# Altium project Dual_tone_generator.PrjPcb
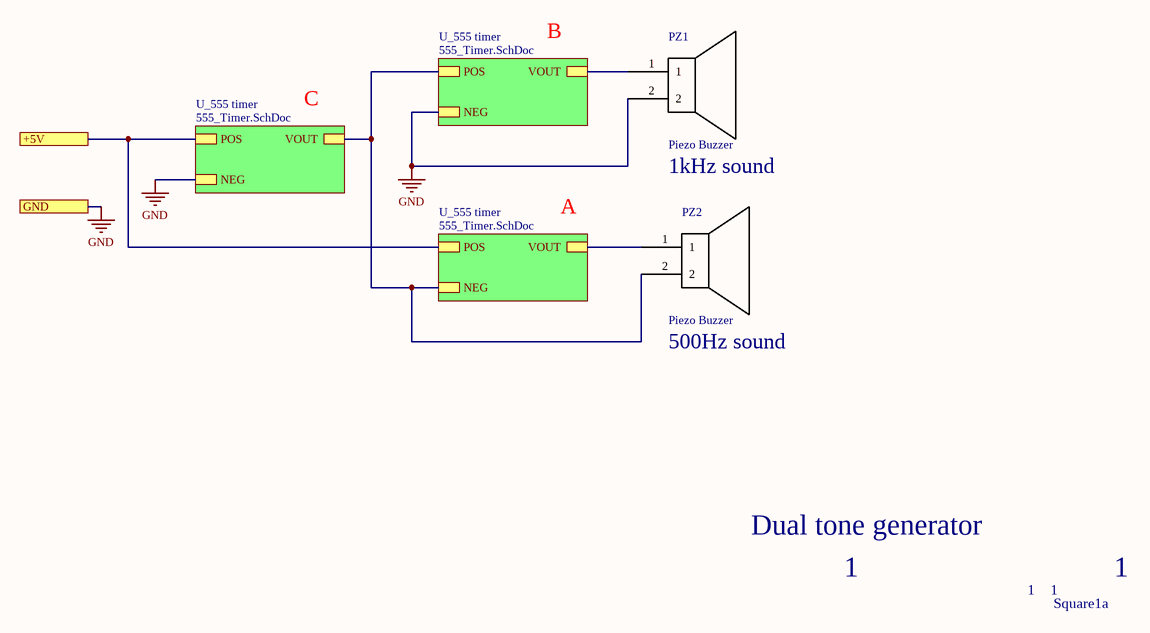
[diagram p0: Dual_tone_generator.SchDoc]
2 sheets, 26 parts. Net scope: hierarchical (ports join the sheet entries above them; power ports are global).
Board file: dual_tone.PcbDoc
Sheets:
  Dual_tone_generator.SchDoc
    U_555 timer = 555_Timer.SchDoc
    U_555 timer = 555_Timer.SchDoc
    U_555 timer = 555_Timer.SchDoc

## Sheet Dual_tone_generator.SchDoc
size A4; SheetNumber: 1; SheetTotal: 2

### Parts
PZ1  Piezo Buzzer  [Buzzer]
PZ2  Piezo Buzzer  [Buzzer]

### Sub-sheets
U_555 timer = 555_Timer.SchDoc: VOUT, NEG, POS
U_555 timer = 555_Timer.SchDoc: VOUT, POS, NEG
U_555 timer = 555_Timer.SchDoc: VOUT, POS, NEG

### Ports
+5V, GND

### Nets
GND: PZ1.2 ; port GND, sheet U_555 timer/NEG, sheet U_555 timer/NEG  [project net NEG]
NEG: PZ2.2 ; sheet U_555 timer/VOUT, sheet U_555 timer/POS, sheet U_555 timer/NEG
POS: port +5V, sheet U_555 timer/POS, sheet U_555 timer/POS
VOUT: PZ1.1 ; sheet U_555 timer/VOUT
VOUT: PZ2.1 ; sheet U_555 timer/VOUT  [a separate net that carries the same name]

### Notes on the sheet
- B
- C
- 1kHz sound
- A
- 500Hz sound
- Dual tone generator
- 1
- Square1a

### Library data of the parts
PZ1 PZ2 = TP124005-2: High Temp Piezo Transducer; Resonant Frequency: 4000Hz; Rated Voltage: 5V; SPL @ 10cm: 75dBA; Manufacturer: DB Unlimited; Supplier 1: Digi-Key; Manufacturer Part Number: TP124005-2; RoHS: No; Category: Audio Products; Stock 1: 2115; Pricing 1: 1=0.78000, 10=0.64900, 25=0.60120, 50=0.56620, 100=0.53260 (USD); Supplier Part Number 1: 2104-TP124005-2CT-ND

## Sheet 555_Timer.SchDoc
size A4; SheetNumber: 2; SheetTotal: 2
Used 3 times, as channels U_555 timer, U_555 timer, U_555 timer. Parts and nets are listed once, with the designators drawn on the sheet.
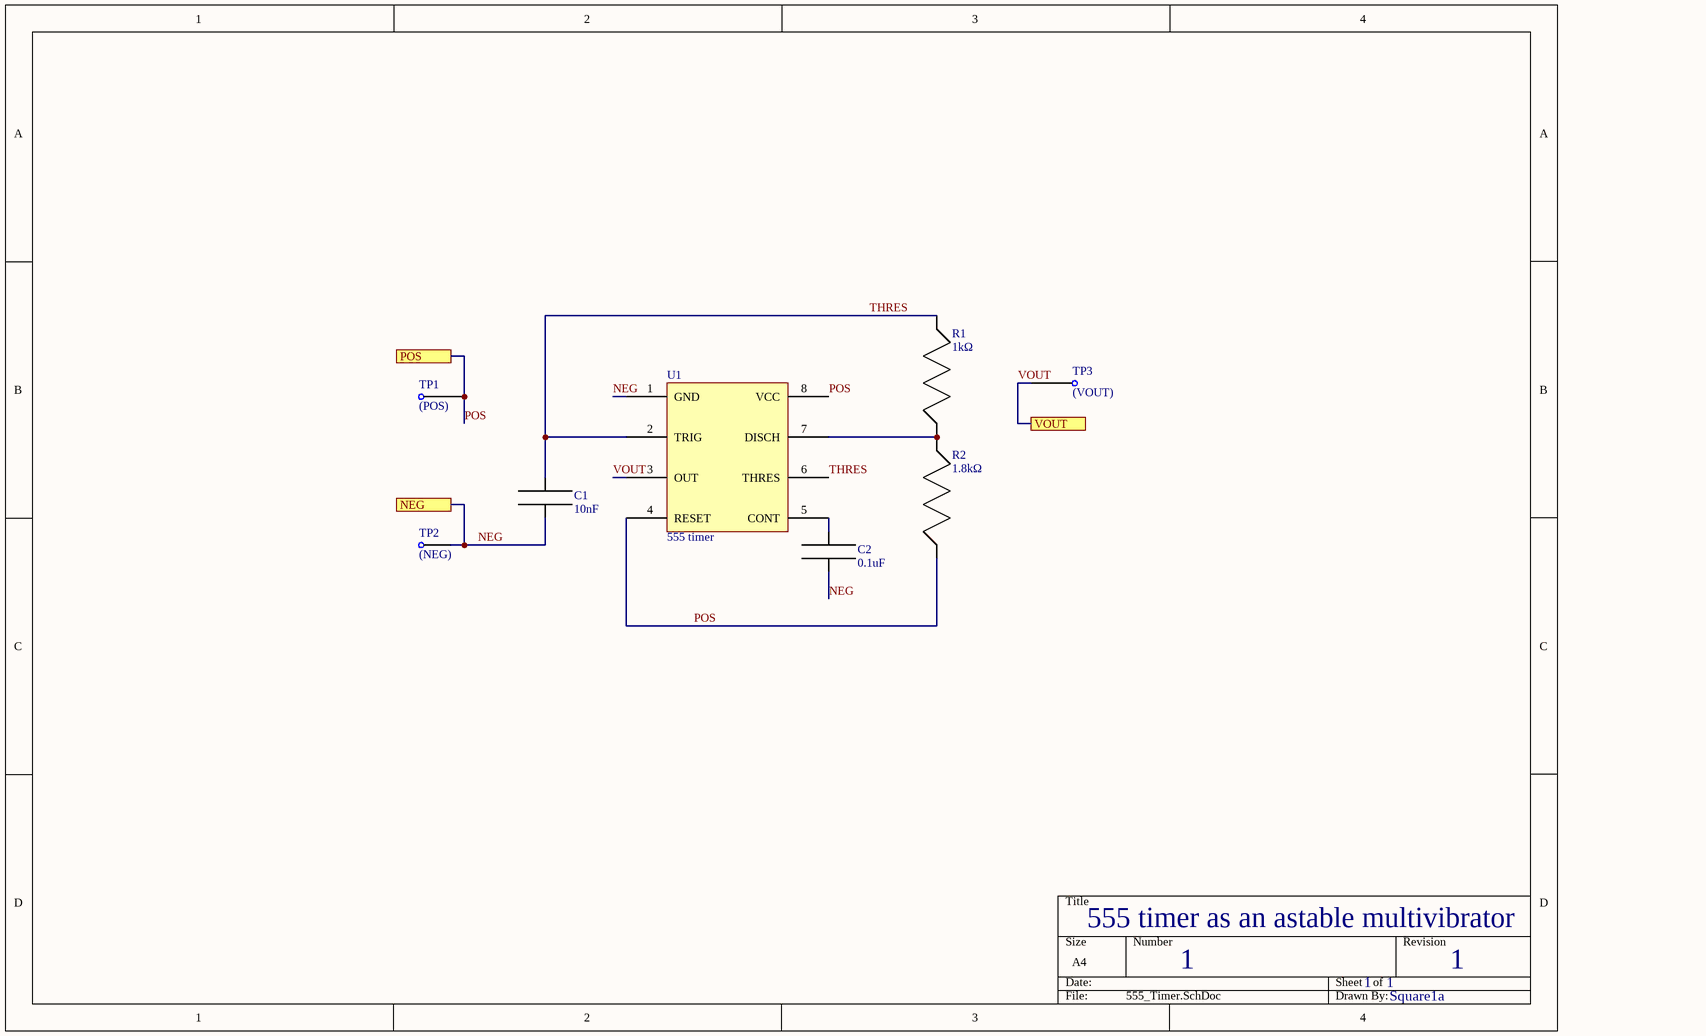
[diagram p1: 555_Timer.SchDoc]

### Parts
C1  10nF  [Capacitor]
C2  0.1uF  [Capacitor]
R1  1kΩ  [Through hole resistor]
R2  1.8kΩ  [Through hole resistor]
TP1  (POS)  [TEST_POINT]
TP2  (NEG)  [TEST_POINT]
TP3  (VOUT)  [TEST_POINT]
U1  555 timer  [DIP8]

### Ports
NEG, POS, VOUT

### Nets
NEG: C1.1 C2.1 TP2.1 U1.1(GND) ; port NEG
POS: R2.1 TP1.1 U1.4(RESET) U1.8(VCC) ; port POS
THRES: C1.2 R1.2 U1.2(TRIG) U1.6(THRES)
VOUT: TP3.1 U1.3(OUT) ; port VOUT
NetC2_2: C2.2 U1.5(CONT)
NetR1_1: R1.1 R2.2 U1.7(DISCH)

### Channels
U_555 timer: designators C1=C1C C2=C2C R1=R1C R2=R2C TP1=+5V TP2=GND TP3=TP3C U1=U1C; ports NEG=NEG POS=POS VOUT=NEG
U_555 timer: designators end in B; ports NEG=NEG POS=NEG VOUT=VOUT
U_555 timer: designators end in A; ports NEG=NEG POS=POS VOUT=VOUT

### Notes on the sheet
- 555 timer as an astable multivibrator
- 1
- Square1a

### Library data of the parts
C1 = C0603X103K1RAC3316: Cap Ceramic 0.01uF 100V X7R 10% SMD 0603 125°C Paper T/R; Manufacturer: KEMET; Supplier 1: RSComponents; Manufacturer Part Number: C0603X103K1RAC3316; RoHS: Yes; Category: Ceramic Capacitors; Stock 1: 200; Pricing 1: 4000=0.07200, 16000=0.07100 (GBP); Case Code (Metric): 1608; Case Code (Imperial): 0603; Min Operating Temperature: -55°C; Max Operating Temperature: 125°C; Capacitance: 10nF; Voltage Rating: 100V; Dielectric: X7R; Packaging: Cut Tape; Tolerance: 10%; Voltage Rating (DC): 100V; REACH SVHC: No SVHC; RoHS Compliant: Yes; ComponentLink1URL: http://www.farnell.com/datasheets/2821142.pdf?src-supplier=Farnell; ComponentLink1Description: http://www.farnell.com/datasheets/2821142.pdf?src-supplier=Farnell; ComponentLink2URL: http://www.farnell.com/datasheets/2163236.pdf?src-supplier=Element14; ComponentLink2Description: http://www.farnell.com/datasheets/2163236.pdf?src-supplier=Element14; Supplier Part Number 1: 1881957
C2 = 885012208009: Cap, 0.1ΜF, 10V, 10%, X7R, 1206; Manufacturer: Wurth Electronics; Capacitance: 100nF; Supplier 1: Digi-Key; Manufacturer Part Number: 885012208009; RoHS: Yes; Category: Ceramic Capacitors; Stock 1: 5980; Pricing 1: 1=0.12000, 10=0.10600, 100=0.09500, 500=0.08300 (USD); Mount: Surface Mount; Case/Package: 1206; Case Code (Metric): 3216; Case Code (Imperial): 1206; Min Operating Temperature: -55°C; Max Operating Temperature: 125°C; Packaging: Tape and Reel; Voltage Rating: 10V; Tolerance: 10%; Length: 0.126inch; Width: 0.063inch; Thickness: 0.035inch; RoHS Compliant: Yes; ComponentLink1URL: http://www.farnell.com/datasheets/2031891.pdf?src-supplier=Farnell; ComponentLink1Description: http://www.farnell.com/datasheets/2031891.pdf?src-supplier=Farnell; ComponentLink2URL: http://katalog.we-online.de/pbs/datasheet/885012208009.pdf?src-supplier=Digi-Key; ComponentLink2Description: http://katalog.we-online.de/pbs/datasheet/885012208009.pdf?src-supplier=Digi-Key; ComponentLink3URL: https://katalog.we-online.de/pbs/datasheet/885012208009.pdf?src-supplier=Digi-Key; ComponentLink3Description: https://katalog.we-online.de/pbs/datasheet/885012208009.pdf?src-supplier=Digi-Key; Supplier Part Number 1: 732-8086-1-ND
R1 = SFR2500001001JA500: Res Metal Film 1K Ohm 5% 2/5W ±100ppm/°C Conformal AXL Thru-Hole Ammo Pack; Manufacturer: Vishay BCcomponents; Resistance: 1kR; Power Rating: 400mW; Voltage Rating: 250V; Lead Diameter: 0.58mm; Lead Length: 26mm; Supplier 1: Arrow Electronics; Manufacturer Part Number: SFR2500001001JA500; RoHS: Yes; Category: Through-Hole Resistors; Stock 1: 1000; Pricing 1: 1=0.17130, 10=0.13160, 25=0.10310, 100=0.04400, 250=0.03870, 500=0.03240, 1000=0.02600 (USD); Case/Package: Conformal; Contact Plating: Tin; Min Operating Temperature: -55°C; Max Operating Temperature: 155°C; Tolerance: 5%; Resistor Type: Metal Film; Packaging: Tape and Reel; Number of Terminations: 2; Termination: Axial; Max Power Dissipation: 400mW; Temperature Coefficient: 100ppm/°C; Series: SFR25; Resistance Tolerance: 5%; Construction: Cylindrical; Diameter: 2.5mm; Length: 7.5mm; Radiation Hardening: No; REACH SVHC: Unknown; Military Standard: Not; RoHS Compliant: Yes; ComponentLink1URL: https://datasheet.ciiva.com/8323/sfr16s25-8323400.pdf?src-supplier=Avnet; ComponentLink1Description: https://datasheet.ciiva.com/8323/sfr16s25-8323400.pdf?src-supplier=Avnet; Supplier Part Number 1: SFR2500001001JA500
R2 = MFR-25FTE52-1K8: General Type Metal Film Resistor 1.8kOhm 1/4W 1% Axial Ammo Pack; Manufacturer: Yageo; Resistance: 1.8kR; Voltage Rating: 250V; Power Rating: 250mW; Supplier 1: RSComponents; Manufacturer Part Number: MFR-25FTE52-1K8; Category: Resistors; Stock 1: 5000; Pricing 1: 5000=0.00800 (GBP); Mount: Through Hole; Case/Package: Conformal; Min Operating Temperature: -55°C; Max Operating Temperature: 155°C; Tolerance: 1%; Termination: Axial; Resistor Type: Metal Film; Construction: Cylindrical; Length: 6.3mm; Military Standard: Not; ComponentLink1URL: http://www.mouser.com/ds/2/447/Yageo%20LR_MFR_2013-467719.pdf?src-supplier=Mouser; ComponentLink1Description: http://www.mouser.com/ds/2/447/Yageo%20LR_MFR_2013-467719.pdf?src-supplier=Mouser; ComponentLink2URL: http://www.yageo.com/NewPortal/yageodocoutput?fileName=/pdf/throughhole/Yageo_LR_MFR_2013.pdf&src-supplier=Digi-Key; ComponentLink2Description: http://www.yageo.com/NewPortal/yageodocoutput?fileName=/pdf/throughhole/Yageo_LR_MFR_2013.pdf&src-supplier=Digi-Key; ComponentLink3URL: https://datasheet.octopart.com/MFR-25FTE52-1K8-Yageo-datasheet-155367622.pdf?src-supplier=Future+Electronics; ComponentLink3Description: https://datasheet.octopart.com/MFR-25FTE52-1K8-Yageo-datasheet-155367622.pdf?src-supplier=Future+Electronics; ComponentLink4URL: https://datasheet.octopart.com/MFR-25FTE52-1K8-Yageo-datasheet-28066692.pdf; ComponentLink4Description: https://datasheet.octopart.com/MFR-25FTE52-1K8-Yageo-datasheet-28066692.pdf; Supplier Part Number 1: 1997607
TP1 = 5010: Polyurethane Multi-Purpose Cream Adhesive, 10.3 oz Cartridge; Manufacturer: Keystone Electronics; Body Material: Bronze,PBT; Plating: Silver; Number of Ports: 1; Inside Diameter: 1.78mm; Hole Diameter: 1.6mm; Supplier 1: Digi-Key; Manufacturer Part Number: 5010; RoHS: Yes; Category: Connectors; Stock 1: 546313; Pricing 1: 1=0.42000, 25=0.34080, 100=0.30150, 250=0.28304, 500=0.25230, 1000=0.19884, 2500=0.18180, 5000=0.17044 (USD); Mount: Through Hole,PCB; Contact Material: Bronze; Contact Plating: Silver,Tin; Color: Red; Material: Nylon,Bronze,Silver; Housing Color: Red; Insulation Material: Nylon; Packaging: Bulk; Series: THM; Package Quantity: 100; Termination: Through Hole; Orientation: Straight; Length: 11.3mm; Height: 0.445inch; Lead Free: Lead Free; Flammability Rating: UL94 V-0; RoHS Compliant: Yes; REACH SVHC: No SVHC; ComponentLink1URL: https://datasheet.ciiva.com/11744/0900766b8009b7c7-11744920.pdf?src-supplier=RSComponents; ComponentLink1Description: https://datasheet.ciiva.com/11744/0900766b8009b7c7-11744920.pdf?src-supplier=RSComponents; ComponentLink2URL: https://datasheet.ciiva.com/16506/m60-2p60-16506972.pdf?src-supplier=Future+Electronics; ComponentLink2Description: https://datasheet.ciiva.com/16506/m60-2p60-16506972.pdf?src-supplier=Future+Electronics; ComponentLink3URL: https://datasheet.ciiva.com/16883/70182825-16883886.pdf?src-supplier=Allied+Electronics; ComponentLink3Description: https://datasheet.ciiva.com/16883/70182825-16883886.pdf?src-supplier=Allied+Electronics; ComponentLink4URL: https://datasheet.ciiva.com/1454/1703983-1454833.pdf?src-supplier=Element14; ComponentLink4Description: https://datasheet.ciiva.com/1454/1703983-1454833.pdf?src-supplier=Element14; ComponentLink5URL: https://datasheet.ciiva.com/22631/1703983-22631113.pdf?src-supplier=Element14; ComponentLink5Description: https://datasheet.ciiva.com/22631/1703983-22631113.pdf?src-supplier=Element14; ComponentLink6URL: https://datasheet.ciiva.com/2917/5010-2917626.pdf?src-supplier=Digi-Key; ComponentLink6Description: https://datasheet.ciiva.com/2917/5010-2917626.pdf?src-supplier=Digi-Key; Supplier Part Number 1: 36-5010-ND
TP2 = 5011: Test Point MultiPurpose THM H .445 Nylon 46 Insulated Blk PhosBronze/Silver; Manufacturer: Keystone Electronics; Body Material: PBT; Gender: Female; Number of Ports: 1; Inside Diameter: 1.78mm; Hole Diameter: 1.6mm; Supplier 1: RSComponents; Manufacturer Part Number: 5011; RoHS: Yes; Category: Connectors; Stock 1: 100; Pricing 1: 100=0.30800, 500=0.29900, 1000=0.29100, 4000=0.28400 (GBP); Mount: PCB,Through Hole; Contact Material: Bronze; Contact Plating: Silver,Tin; Color: Black; Material: Nylon,Bronze,Silver; Housing Color: Black; Packaging: Bulk; Package Quantity: 100; Orientation: Straight; Series: THM; Length: 11.3mm; Lead Free: Lead Free; REACH SVHC: No SVHC; RoHS Compliant: Yes; Flammability Rating: UL94 V-0; ComponentLink1URL: https://datasheet.ciiva.com/11744/0900766b8009b7c7-11744935.pdf?src-supplier=RSComponents; ComponentLink1Description: https://datasheet.ciiva.com/11744/0900766b8009b7c7-11744935.pdf?src-supplier=RSComponents; ComponentLink2URL: https://datasheet.ciiva.com/1454/1718230-1454834.pdf?src-supplier=Element14; ComponentLink2Description: https://datasheet.ciiva.com/1454/1718230-1454834.pdf?src-supplier=Element14; ComponentLink3URL: https://datasheet.ciiva.com/16351/m60-2p60-16351093.pdf?src-supplier=Future+Electronics; ComponentLink3Description: https://datasheet.ciiva.com/16351/m60-2p60-16351093.pdf?src-supplier=Future+Electronics; ComponentLink4URL: https://datasheet.ciiva.com/2917/5011-2917635.pdf?src-supplier=Digi-Key; ComponentLink4Description: https://datasheet.ciiva.com/2917/5011-2917635.pdf?src-supplier=Digi-Key; ComponentLink5URL: https://datasheet.ciiva.com/46412/1703983-46412138.pdf?src-supplier=Element14; ComponentLink5Description: https://datasheet.ciiva.com/46412/1703983-46412138.pdf?src-supplier=Element14; Supplier Part Number 1: 2042652
TP3 = 5014: Test Point MultiPurpose THM H .445 Nylon 46 Insulated Yel PhosBronze/Silver; Manufacturer: Keystone Electronics; Body Material: PBT; Inside Diameter: 1.78mm; Supplier 1: Newark; Manufacturer Part Number: 5014; RoHS: Yes; Category: Connectors; Stock 1: 46110; Pricing 1: 1=0.26400, 10=0.25400, 100=0.24000, 500=0.17900, 1000=0.15400, 2500=0.13300, 10000=0.11100 (USD); Mount: Through Hole,PCB; Contact Material: Bronze; Contact Plating: Silver,Tin; Color: Yellow; Material: Nylon,Bronze,Silver; Packaging: Bulk; Termination: Through Hole; Series: THM; Package Quantity: 100; Length: 11.3mm; Height: 0.445inch; Lead Free: Lead Free; REACH SVHC: No SVHC; RoHS Compliant: Yes; Flammability Rating: UL94 V-0; ComponentLink1URL: https://datasheet.ciiva.com/2917/5014-2917636.pdf?src-supplier=Digi-Key; ComponentLink1Description: https://datasheet.ciiva.com/2917/5014-2917636.pdf?src-supplier=Digi-Key; ComponentLink2URL: https://datasheet.ciiva.com/16297/m60-2p60-16297225.pdf?src-supplier=Future+Electronics; ComponentLink2Description: https://datasheet.ciiva.com/16297/m60-2p60-16297225.pdf?src-supplier=Future+Electronics; ComponentLink3URL: https://datasheet.ciiva.com/22631/1703983-22631119.pdf?src-supplier=Element14; ComponentLink3Description: https://datasheet.ciiva.com/22631/1703983-22631119.pdf?src-supplier=Element14; ComponentLink4URL: https://datasheet.ciiva.com/16884/70182825-16884159.pdf?src-supplier=Allied+Electronics; ComponentLink4Description: https://datasheet.ciiva.com/16884/70182825-16884159.pdf?src-supplier=Allied+Electronics; Supplier Part Number 1: 62W5146
U1 = NE555P: IC OSC SINGLE TIMER 100KHZ 8-DIP; Manufacturer: Texas Instruments; Frequency: 500kHz; Min Supply Voltage: 4.5V; Max Supply Voltage: 16V; Operating Supply Voltage: 5V; Current Rating: 10mA; Nominal Supply Current: 2mA; Number of Timers/Counters: 1; Quiescent Current: 15mA; High Level Output Current: -200mA; Low Level Output Current: 200mA; Supplier 1: Digi-Key; Manufacturer Part Number: NE555P; RoHS: Yes; Category: Clock and Timing; Stock 1: 8993; Pricing 1: 1=0.48000, 10=0.41300, 25=0.38600, 100=0.30870, 250=0.28664, 500=0.24252, 1000=0.18741, 2500=0.17087, 5000=0.16640 (USD); Mount: Through Hole; Case/Package: PDIP; Number of Pins: 8; Weight: 0.015535oz; Contact Plating: Gold; Min Operating Temperature: 0°C; Max Operating Temperature: 70°C; Packaging: Rail/Tube; Package Quantity: 50; Operating Supply Current: 10mA; Length: 9.81mm; Width: 6.35mm; Height: 4.57mm; Radiation Hardening: No; REACH SVHC: No SVHC; Lead Free: Lead Free; RoHS Compliant: Yes; ComponentLink1URL: https://datasheet.ciiva.com/19457/904085-19457361.pdf?src-supplier=Jameco; ComponentLink1Description: https://datasheet.ciiva.com/19457/904085-19457361.pdf?src-supplier=Jameco; ComponentLink2URL: https://datasheet.ciiva.com/1139/sa555-1139904.pdf?src-supplier=Element14; ComponentLink2Description: https://datasheet.ciiva.com/1139/sa555-1139904.pdf?src-supplier=Element14; ComponentLink3URL: https://datasheet.ciiva.com/26325/152184-da-01-en-ne555p-timer-tid-26325915.pdf?src-supplier=Conrad; ComponentLink3Description: https://datasheet.ciiva.com/26325/152184-da-01-en-ne555p-timer-tid-26325915.pdf?src-supplier=Conrad; ComponentLink4URL: https://datasheet.ciiva.com/14094/ne555-series-eng-tds-14094950.pdf?src-supplier=Distrelec; ComponentLink4Description: https://datasheet.ciiva.com/14094/ne555-series-eng-tds-14094950.pdf?src-supplier=Distrelec; ComponentLink5URL: https://datasheet.ciiva.com/1233/ne555-1233454.pdf?src-supplier=Digi-Key; ComponentLink5Description: https://datasheet.ciiva.com/1233/ne555-1233454.pdf?src-supplier=Digi-Key; ComponentLink6URL: https://datasheet.ciiva.com/1147/1764032-1147750.pdf?src-supplier=Newark; ComponentLink6Description: https://datasheet.ciiva.com/1147/1764032-1147750.pdf?src-supplier=Newark; ComponentLink7URL: https://datasheet.ciiva.com/14274/ne555-14274456.pdf?src-supplier=Avnet; ComponentLink7Description: https://datasheet.ciiva.com/14274/ne555-14274456.pdf?src-supplier=Avnet; ComponentLink8URL: https://datasheet.ciiva.com/15152/getdatasheetpartid-248510-15152620.pdf?src-supplier=Verical; ComponentLink8Description: https://datasheet.ciiva.com/15152/getdatasheetpartid-248510-15152620.pdf?src-supplier=Verical; Supplier Part Number 1: 296-NE555P-ND

## Nets that join several sheets
NEG: Dual_tone_generator (PZ1.2), U_555 timer (C1C.1 C2C.1 GND.1 U1C.1), U_555 timer (C1B.1 C2B.1 TP2B.1 U1B.1)
NEG: Dual_tone_generator (PZ2.2), U_555 timer (TP3C.1 U1C.3), U_555 timer (R2B.1 TP1B.1 U1B.4 U1B.8), U_555 timer (C1A.1 C2A.1 TP2A.1 U1A.1)
POS: U_555 timer (+5V.1 R2C.1 U1C.4 U1C.8), U_555 timer (R2A.1 TP1A.1 U1A.4 U1A.8)
VOUT: Dual_tone_generator (PZ1.1), U_555 timer (TP3B.1 U1B.3)
VOUT: Dual_tone_generator (PZ2.1), U_555 timer (TP3A.1 U1A.3)